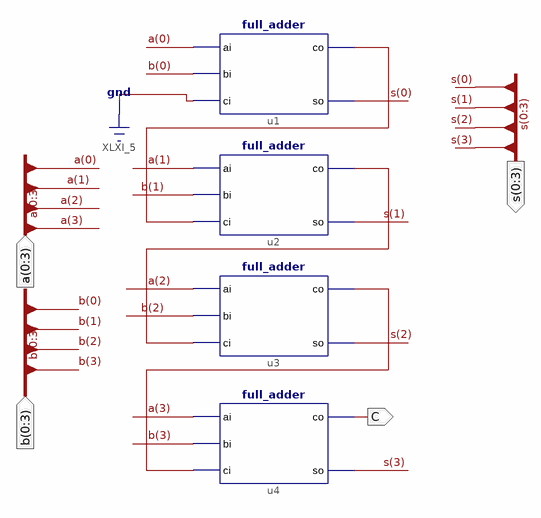
[diagram p0: schematic sheet 1]
// Xilinx ISE schematic fa_4bit.sch (spartan6) as structural Verilog: 4 symbols, 4 ports
module fa_4bit (
  input  [0:3] b,
  input  [0:3] a,
  output C,
  output [0:3] s
);

  wire XLXN_1, XLXN_2, XLXN_3;

  full_adder u1 (.ai(a[0]), .bi(b[0]), .ci(1'b0), .co(XLXN_1), .so(s[0]));
  full_adder u2 (.ai(a[1]), .bi(b[1]), .ci(XLXN_1), .co(XLXN_2), .so(s[1]));
  full_adder u3 (.ai(a[2]), .bi(b[2]), .ci(XLXN_2), .co(XLXN_3), .so(s[2]));
  full_adder u4 (.ai(a[3]), .bi(b[3]), .ci(XLXN_3), .co(C), .so(s[3]));
endmodule
